# EAGLE design r0ket_v2 (EAGLE 6.2)
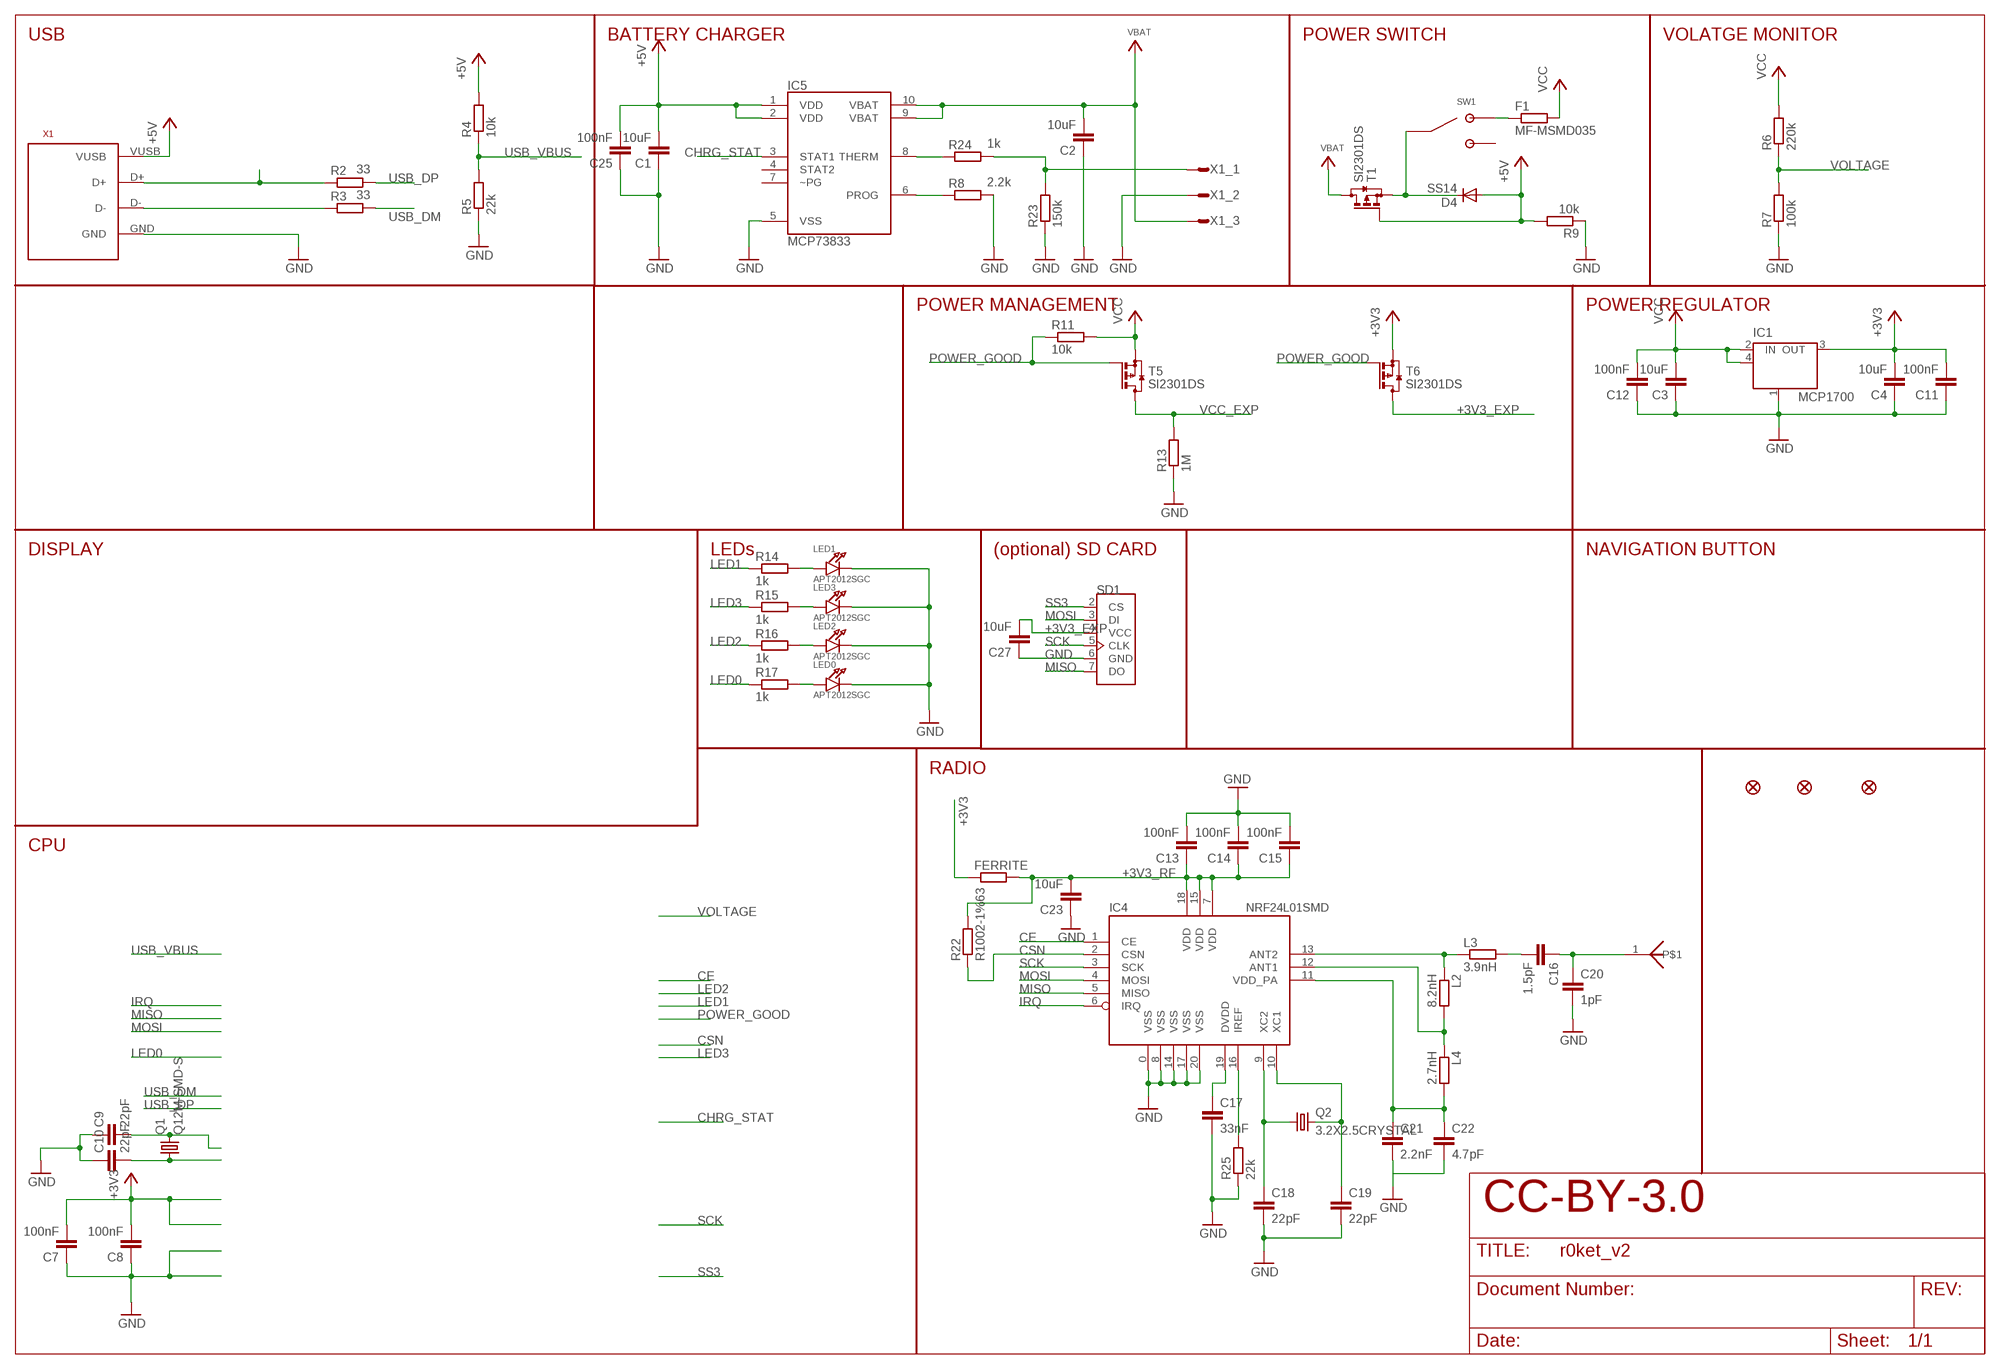
[diagram p0: schematic, sheet 1]

## Parts
ANT  CHIPANTENNA  [CHIPANTENNA]
C1  10uF  C-EUC0805K  [C0805K]
C2  10uF  C-EUC0805K  [C0805K]
C3  10uF  C-EUC0805K  [C0805K]
C4  10uF  C-EUC0805K  [C0805K]
C7  100nF  C-EUC0402K  [C0402K]
C8  100nF  C-EUC0402K  [C0402K]
C9  22pF  C-EUC0402K  [C0402K]
C10  22pF  C-EUC0402K  [C0402K]
C11  100nF  C-EUC0402K  [C0402K]
C12  100nF  C-EUC0402K  [C0402K]
C13  100nF  C-EUC0402K  [C0402K]
C14  100nF  C-EUC0402K  [C0402K]
C15  100nF  C-EUC0402K  [C0402K]
C16  1.5pF  C-EUC0402K  [C0402K]
C17  33nF  C-EUC0402K  [C0402K]
C18  22pF  C-EUC0402K  [C0402K]
C19  22pF  C-EUC0402K  [C0402K]
C20  1pF  C-EUC0402K  [C0402K]
C21  2.2nF  C-EUC0402K  [C0402K]
C22  4.7pF  C-EUC0402K  [C0402K]
C23  10uF  C-EUC0805K  [C0805K]
C25  100nF  C-EUC0402K  [C0402K]
C27  10uF  C-EUC0805K  [C0805K]
D4  SS14  DIODE-SMB  [SMB]
F1  MF-MSMD035  R-EU_R1210  [R1210]
FERRITE  R-EU_R0805  [R0805]
FID1  FIDUCIAL1.5X3  [FIDUCIAL-1.5X3]
FID2  FIDUCIAL1.5X3  [FIDUCIAL-1.5X3]
FID3  FIDUCIAL1.5X3  [FIDUCIAL-1.5X3]
IC1  MCP1700  [SOT89]
IC4  NRF24L01SMD  [QFN20]
IC5  MCP73833  [MSOP-10]
L2  8.2nH  R-EU_R0402  [R0402]
L3  3.9nH  R-EU_R0402  [R0402]
L4  2.7nH  R-EU_R0402  [R0402]
LED0  APT2012SGC  LED0805  [CHIPLED_0805]
LED1  APT2012SGC  LED0805  [CHIPLED_0805]
LED2  APT2012SGC  LED0805  [CHIPLED_0805]
LED3  APT2012SGC  LED0805  [CHIPLED_0805]
Q1  Q12M-SMD-S  CRYSTALCTS406  [CTS406]
Q2  3.2X2.5CRYSTAL  [CRYSTAL3.2X2.5]
R2  33  R-EU_R0603  [R0603]
R3  33  R-EU_R0603  [R0603]
R4  10k  R-EU_R0603  [R0603]
R5  22k  R-EU_R0603  [R0603]
R6  220k  R-EU_R0603  [R0603]
R7  100k  R-EU_R0603  [R0603]
R8  2.2k  R-EU_R0603  [R0603]
R9  10k  R-EU_R0603  [R0603]
R11  10k  R-EU_R0603  [R0603]
R13  1M  R-EU_R0603  [R0603]
R14  1k  R-EU_R0603  [R0603]
R15  1k  R-EU_R0603  [R0603]
R16  1k  R-EU_R0603  [R0603]
R17  1k  R-EU_R0603  [R0603]
R22  R1002-1%63  R-EU_R0603  [R0603]
R23  150k  R-EU_R0603  [R0603]
R24  1k  R-EU_R0603  [R0603]
R25  22k  R-EU_R0603  [R0603]
SD1  MICROSD_SF-MICROSD  [MICROSD_MICROSD]
SW1  JS102011SAQN  [JS102011SAQN]
T1  SI2301DS  BSS84  [SOT23]
T5  SI2301DS  BSS84  [SOT23]
T6  SI2301DS  BSS84  [SOT23]
X1  MICROUSB  [MICROAB]
X1_  JST-PH3  [JST-PH3]

## Nets
+3V3 [GND/3V3]: C4.2 C7.2 C8.2 C11.2 FERRITE.1 IC1.3(OUT) T6.2(S)
+3V3_EXP [FAT]: C27.2 SD1.4(VCC) T6.3(D)
+3V3_RF: C13.1 C14.1 C15.1 C23.2 FERRITE.2 IC4.7(VDD) IC4.15(VDD) IC4.18(VDD) R22.2
+5V [FAT]: C1.2 C25.2 D4.A IC5.1(VDD) IC5.2(VDD) R4.2 R9.2 T1.1(G) X1.VUSB
CE: IC4.1(CE)
CHRG_STAT: IC5.3(STAT1)
CSN: IC4.2(CSN) R22.1
D+: R2.2 X1.D+
D-: R3.2 X1.D-
GND [GND/3V3]: C1.1 C2.1 C3.1 C4.1 C7.1 C8.1 C9.1 C10.1 C11.1 C12.1 C13.2 C14.2 C15.2 C17.2 C18.2 C19.2 C20.2 C21.2 C22.2 C23.1 C25.1 C27.1 IC1.1(GND/ADJ) IC4.0(VSS) IC4.8(VSS) IC4.14(VSS) IC4.17(VSS) IC4.20(VSS) IC5.5(VSS) LED0.C LED1.C LED2.C LED3.C R5.1 R7.1 R8.1 R9.1 R13.1 R23.1 R25.1 SD1.6(GND) X1.GND X1_.2
IRQ: IC4.6(IRQ)
LED0: R17.1
LED1: R14.1
LED2: R16.1
LED3: R15.1
MISO: IC4.5(MISO) SD1.7(DO)
MOSI: IC4.4(MOSI) SD1.3(DI)
N$1: C9.2 Q1.3
N$2: IC5.8(THERM) R24.2
N$3: C10.2 Q1.1
N$4: LED0.A R17.2
N$5: LED2.A R16.2
N$6: LED3.A R15.2
N$7: R23.2 R24.1 X1_.1
N$8 [FAT]: D4.C SW1.2 T1.2(S)
N$9: LED1.A R14.2
N$10: C18.1 IC4.9(XC2) Q2.1
N$11: C19.1 IC4.10(XC1) Q2.3
N$12 [GND/3V3]: ANT.1 C16.1 C20.1
N$13: IC5.6(PROG) R8.2
N$15 [FAT]: F1.1 SW1.1
N$70: C17.1 IC4.19(DVDD)
N$71: IC4.16(IREF) R25.2
N$73: C21.1 C22.1 IC4.11(VDD_PA) L4.2
N$78: IC4.12(ANT1) L2.2 L4.1
N$79: IC4.13(ANT2) L2.1 L3.1
N$80: C16.2 L3.2
POWER_GOOD: R11.1 T5.1(G) T6.1(G)
SCK: IC4.3(SCK) SD1.5(CLK)
SS3: SD1.2(CS)
USB_DM: R3.1
USB_DP: R2.1
USB_VBUS: R4.1 R5.2
VBAT [FAT]: C2.2 IC5.9(VBAT) IC5.10(VBAT) T1.3(D) X1_.3
VCC: C3.2 C12.2 F1.2 IC1.2(IN) IC1.4(IN) R6.2 R11.2 T5.2(S)
VCC_EXP [FAT]: R13.2 T5.3(D)
VOLTAGE: R6.1 R7.2
Unconnected: IC5.4(STAT2) IC5.7(~PG) SW1.3

## Notes on the sheet
- USB | BATTERY CHARGER | POWER SWITCH | VOLATGE MONITOR
- POWER MANAGEMENT | POWER REGULATOR
- DISPLAY | LEDs | (optional) SD CARD | NAVIGATION BUTTON
- RADIO
- CPU
- CC-BY-3.0

## Library data of the parts
ANT = badge:CHIPANTENNA
C1-C4 C7-C23 C25 C27 = rcl:C-EU: CAPACITOR, European symbol
D4 = diode:DIODE-: DIODE
F1 FERRITE L2-L4 R2-R9 R11 R13-R17 R22-R25 = rcl:R-EU_: RESISTOR, European symbol
FID1-FID3 = SparkFun:FIDUCIAL: Fiducial Alignment Points Various fiducial points for machine vision alignment.
IC1 = badge:MCP1700
IC4 = SparkFun:NRF24L01: 2.4GHz Low Power Transceiver This is the very popular, low cost, very low power RF transceiver from Nordic Semiconductor. Simple SPI interface. SKU: COM-00690
IC5 = SparkFun:MCP73833: Microchip MCP73833 Stand-alone Linear Li-ion/Li-polymer Charge Management Controller Packages: DFN-10, MSOP-10 Last modified: 8/17/10 Unproven!
LED0 LED1-LED3 = microbuilder:LED: LED 0603 - 0603 Surface Mount Package Green LED - Low Power (3.9mcd, 2ma, 1.7Vf) Orange LED - Low Power (9.8mcd, 2ma, 1.8Vf) Red LED - Low Power (5mcd, 2ma, 1.8Vf) Yellow LED - Low Power (7mcd, 2ma, 1.8Vf) 0805 - 0805 Surface Mount Package 20mA: Red LED (104mcd, 20mA, Diffused) - LS R976 [Digikey: 475-1278-6-ND] Red LED (12mcd, 20mA, 2.0Vf, Clear) - APT2012EC [Digikey: 754-1128-1-ND] Green LED (15mcd, 20mA, 2.2Vf, Clear) - APT2012GC [Digikey: 754-1131-1-ND] Orange LED (160mcd, 20mA, 2.1Vf, Clear) - APT2012SECK [Digikey: 754-1130-1-ND] 2mA: Red LED (8.8mcd, 2mA, 1.8Vf, Clear) - Low Power [Digikey: 475-2510-1-ND] Green LED (5mcd, 2mA, 1.8Vf, Clear) - Low Power [Digikey: 475-2730-1-ND] Yellow LED (11.3mcd, 2mA, 1.8Vf, Clear) - Low Power [Digikey: 475-2555-1-ND] 1206 - 1206 Surface Mount Package Green LED (26mcd, 20mA, Diffused) - LG N971 [Digikey: 475-1407-6-ND] Red LED (15mcd, 20mA, Diffused) - LH N974 [Digikey: 475-1416-6-ND]
Q1 = crystal:CRYSTAL: CRYSTAL; OC_FARNELL: unknown; OC_NEWARK: unknown
Q2 = badge:3.2X2.5CRYSTAL
SD1 = sd:MICROSD_SF-MICROSD
SW1 = badge:JS102011SAQN
T1 T5 T6 = transistor-small-signal:BSS84: P-CHANNEL MOS FET
X1 = badge:MICROUSB
X1_ = badge:JST-PH3

## Net classes
1 FAT: width 0.2 mm, drill 0.4 mm
2 GND/3V3: width 0.2 mm, drill 0.4 mm

## Board
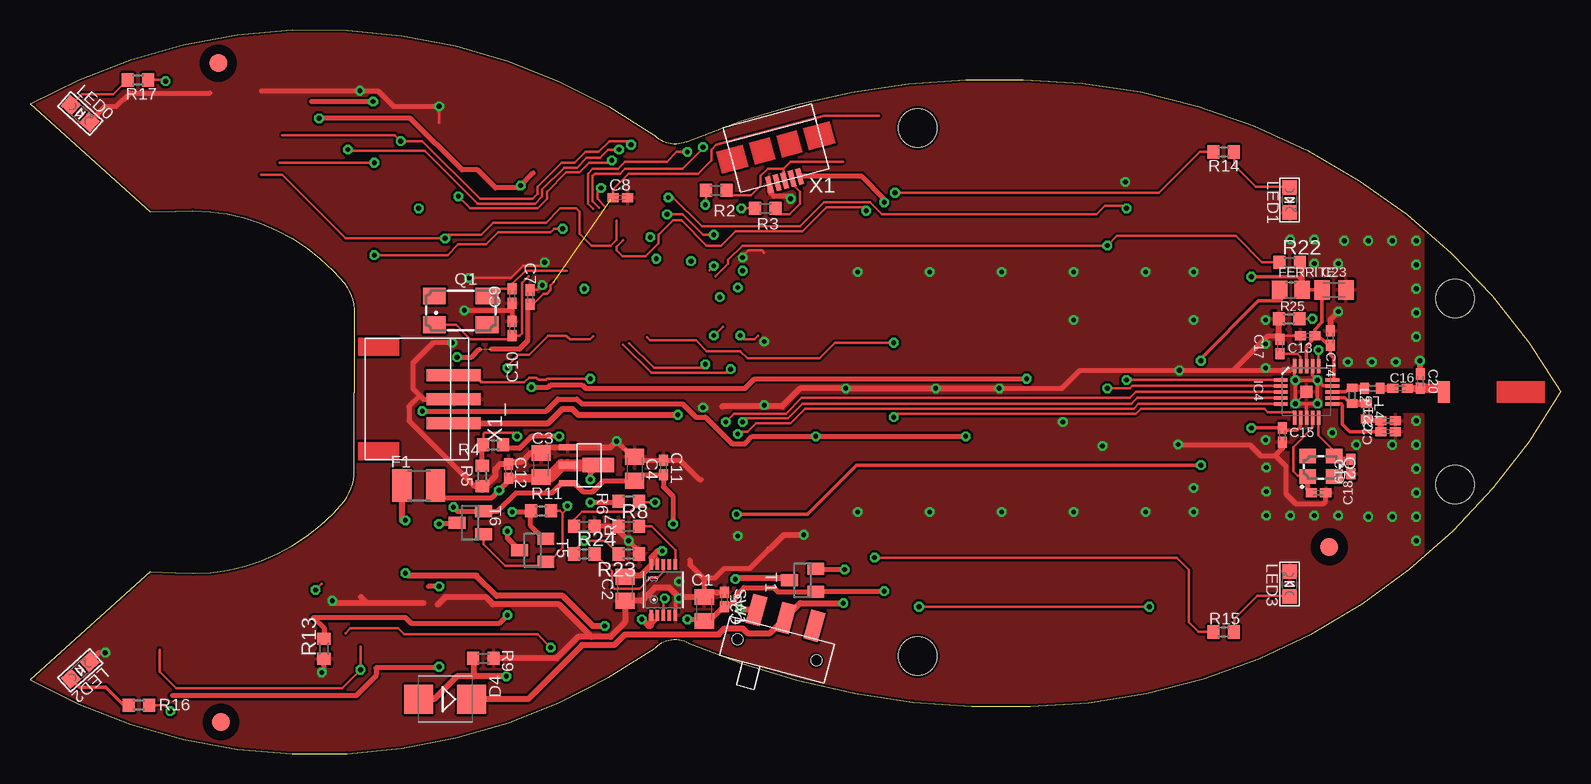
[diagram p1: board, top side]
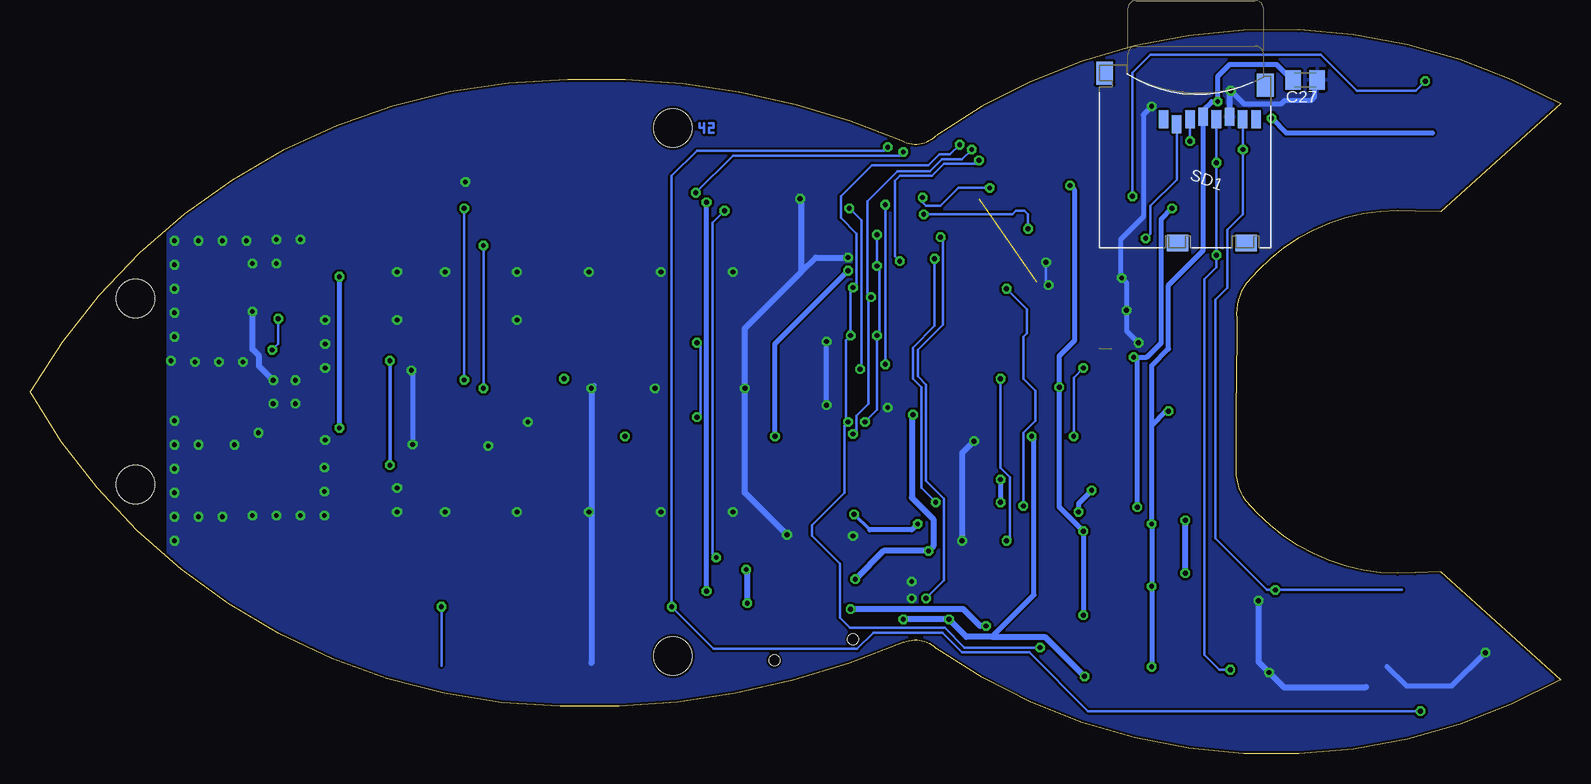
[diagram p2: board, bottom side, seen from below]

Size 127.6 x 60.33 mm. Coordinates in mm from the lower left corner, seen from the top.
Outline: 0,54.16 arc-64 52.1,51.51 arc62 54.52,50.93 54.73,51.02 arc-25 82.8,56.16 arc-59 127.6,30.16 arc-59 83.4,3.96 arc-25 54.73,9.3 54.52,9.39 arc62 52.1,8.81 arc-64 0,6.16 10,15.16 12.14,15.09 arc55 26.23,21.11 arc41 27.02,24 27.02,30.11 27.01,36.31 arc41 26.22,39.2 arc55 12.13,45.22 10,45.16 0,54.16
Copper layers (1*16): Top 0.035mm / dielectric 1.5mm / Bottom 0.035mm
Design rules "default *": minimum track width 0.2mm, minimum drill 0.4mm, track to track 0.2mm, track to pad 6mil, pad to pad 6mil, via to via 0.2mm, smd to smd 6mil, copper to edge 0.2mm, drill to drill 8mil, minimum pad ring 8mil, minimum via ring 0.2mm, stop-mask expansion 4mil, vias tented up to drill 0.4mm, thermal gap 10mil
Holes 3.2 mm at 118.8,37.96 74,8.16 74,52.16 118.8,22.46
tRestrict: area 14.5,1.2 to 17.3,4.1; area 14.3,56.1 to 17.1,59; area 106.9,15.8 to 109.7,18.7

### Footprints (pad centres in the part's own frame; a part is rotated, then mirrored left to right if it is on the bottom)
CHIPANTENNA = smd 1 x 1.8: 1 -2.45,0
C0805K = smd 1.3 x 1.6: 1 -1,0; 2 1,0
C0402K = smd 0.925 x 0.74: 1 -0.6,0; 2 0.6,0
SMB = smd 2.4 x 2.4: A 2.2,0; C -2.2,0
R1210 = smd 1.6 x 2.7: 1 -1.4,0; 2 1.4,0
R0805 = smd 1.3 x 1.5: 1 -0.95,0; 2 0.95,0
FIDUCIAL-1.5X3 = smd 1.5 x 1.5: 1 0,0
SOT89 = smd 0.48 x 1.4: 1 -1.5,-1.6; 3 1.5,-1.6 | smd 0.56 x 1.4: 2 0,-1.6 | smd 1.2 x 2.6: 4 0,0.97
QFN20 = smd 1 x 1: 0 0,0 | smd 1.158 x 0.3: 1 -2.154,1; 2 -2.154,0.5; 3 -2.154,0; 4 -2.154,-0.5; 5 -2.154,-1; 11 2.154,-1; 12 2.154,-0.5; 13 2.154,0; 14 2.154,0.5; 15 2.154,1 | smd 0.3 x 1.158: 6 -1,-2.154; 7 -0.5,-2.154; 8 0,-2.154; 9 0.5,-2.154; 10 1,-2.154; 16 1,2.154; 17 0.5,2.154; 18 0,2.154; 19 -0.5,2.154; 20 -1,2.154
MSOP-10 = smd 0.305 x 0.889: 1 -1,-2.11; 2 -0.5,-2.11; 3 0,-2.11; 4 0.5,-2.11; 5 1,-2.11; 6 1,2.11; 7 0.5,2.11; 8 0,2.11; 9 -0.5,2.11; 10 -1,2.11
R0402 = smd 0.7 x 0.9: 1 -0.65,0; 2 0.65,0
CHIPLED_0805 = smd 1.2 x 1.2: A 0,-1.05; C 0,1.05
CTS406 = smd 1.9 x 1.4: 1 -2.2,-1.2; 2 2.2,-1.2; 3 2.2,1.2; 4 -2.2,1.2
CRYSTAL3.2X2.5 = smd 1.4 x 1.2: 1 -1.1,-0.85; 2 1.1,-0.85; 3 1.1,0.85; 4 -1.1,0.85
R0603 = smd 1 x 1.1: 1 -0.85,0; 2 0.85,0
MICROSD_MICROSD = smd 0.8 x 1.5: 1 -1.94,2.7; 2 -0.84,2.3; 3 0.26,2.7; 4 1.36,2.9; 5 2.46,2.7; 6 3.56,2.9; 7 4.66,2.7; 8 5.76,2.7 | smd 1.4 x 1.9: NC -6.85,6.55; NC3 6.55,5.55 | smd 1.8 x 1.4: NC1 -0.75,-7.6; NC2 4.95,-7.6
JS102011SAQN = smd 1.2 x 2.5: 1 -2.5,2.75; 2 0,2.75; 3 2.5,2.75 | hole 0.9: 3.4,0; -3.4,0
SOT23 = smd 1 x 1.4: 1 -0.95,-1.1; 2 0.95,-1.1; 3 0,1.1
MICROAB = smd 0.4 x 1.4: D+ 0,0; D- -0.65,0; GND 1.3,0; KEY 0.65,0; VUSB -1.3,0
JST-PH3 = smd 1 x 4.5: 1 2,0; 2 0,0; 3 -2,0

### Placement (x,y rotation side)
ANT  120.3,30.16 0 top
C1  56.2,12.06 270 top
C2  49.6,13.76 90 top
C3  42.6,24.06 270 top
C4  50.4,23.76 270 top
C7  41.7,38.06 270 top
C8  49.2,46.36 180 top
C9  40.2,38.16 90 top
C10  40.2,35.46 270 top
C11  52.8,23.86 270 top
C12  39.9,23.56 270 top
C13  106.5,34.86 180 top
C14  108.4,34.66 90 top
C15  104.4,26.56 270 top
C16  114.2,30.46 180 top
C17  104.2,33.96 90 top
C18  107.4,21.76 0 top
C19  110.1,23.96 270 top
C20  115.9,31.06 90 top
C21  113.2,27.76 0 top
C22  113.2,26.86 0 top
C23  108.7,38.66 180 top
C25  57.9,12.86 270 top
C27  21.3,56.16 180 bottom
D4  34.6,4.56 180 top
F1  32.4,22.36 0 top
FERRITE  105.1,38.66 0 top
FID1  15.9,2.66 0 top
FID2  108.3,17.26 0 top
FID3  15.7,57.56 0 top
IC1  46.4,24.06 270 top
IC4  106.4,30.16 0 top
IC5  52.8,13.66 0 top
L2  110.2,29.86 270 top
L3  111.9,30.46 0 top
L4  111.4,28.56 270 top
LED0  4.19,53.36 228 top
LED1  105,46.16 180 top
LED2  4.19,6.96 312 top
LED3  105,14.16 0 top
Q1  35.9,36.96 0 top
Q2  107.6,23.96 0 top
R2  57.2,46.96 0 top
R3  61.3,45.46 0 top
R4  38.6,25.76 0 top
R5  37.7,23.16 90 top
R6  49.9,21.06 180 top
R7  46.2,18.96 180 top
R8  49.9,18.96 0 top
R9  37.8,7.96 180 top
R11  42.6,20.26 180 top
R13  24.5,8.76 90 top
R14  99.5,50.16 0 top
R15  99.5,10.16 0 top
R16  9.07,4.06 180 top
R17  9,56.16 180 top
R22  105,40.96 0 top
R23  49.9,16.66 180 top
R24  46.2,16.66 0 top
R25  104.95,36.26 0 top
SD1  31.17,50.19 0 bottom
SW1  62.27,8.68 345 top
T1  64.4,14.46 90 top
T5  41.9,16.96 90 top
T6  36.7,19.26 90 top
X1  62.91,47.78 195 top
X1_  35.3,29.56 90 top

### Tracks (layer width: path | path; a pad name or v marks a point on that pad's centre or on a via)
+3V3  (via drill 0.4)  (2 unrouted)
  Top 0.2: C7.2 41.8,37.56 42,37.56 42.8,38.36 43.1,38.36 43.4,38.66 43.4,39.06 43.65,39.31 | 70.75,53.16 66.2,53.16 57.2,50.76 56.8,50.36 56.8,49.46 55.7,48.36 49.9,48.36 48.6,47.06 C8.2 48.45,46.21
  Top 0.3: FERRITE.1 104.3,38.66 104.3,37.86 104.2,37.76 102.4,37.76 97.5,32.86 v97.6,32.76 | v97.6,24.06 68.9,24.06 64.8,19.96 v58.9,19.96
  Top 0.4: v35.3,20.56 35.65,20.21 T6.2 38.95,20.21 40.5,21.76 43.5,21.76 44.3,22.56 IC1.3 45.4,22.56 46.1,21.86 46.9,21.86 47.8,22.76 C4.2 51,22.76 51,23.26 C11.2 52.8,22.26 53.6,21.46 v53.6,19.16 | C7.2 41.5,37.26 41.5,34.46 40.8,33.76 38.45,33.76 | 37.45,33.71 36.8,33.06 v35.6,33.06
  Bottom 0.3: v97.6,24.06 v97.6,32.76 | 57.6,18.66 v58.9,19.96
  Bottom 0.4: v32.4,45.46 33.3,44.56 33.3,34.26 34.5,33.06 v35.6,33.06 35.3,32.76 v35.3,20.56 | 57.6,18.66 54.1,18.66 v53.6,19.16
+3V3_EXP  (via drill 0.4)
  Top 0.2: v59.4,40.26 59.4,40.31
  Top 0.4: v34.1,19.16 35.5,19.16 T6.3 | v78,26.46 v65.5,26.46 60.2,26.46 59.6,25.86 58.5,25.86 56.3,28.06 55.5,28.06 54.4,29.16 46,29.16 45.6,29.56 44,29.56 43,28.56 v32.7,28.56 32.8,28.46 | v34.1,7.26 34,7.16 28.84,7.16 28.84,6.5 27.2,4.86 11.86,4.86 | v28.6,54.36 23.46,54.36 | v34.1,13.96 33.2,13.96
  Bottom 0.4: SD1.4 29.8,53.66 29.1,54.36 v28.6,54.36 28.6,56.46 27.6,57.46 23.7,57.46 22.4,56.16 C27.2 | SD1.4 | v34.1,7.26 v34.1,13.96 v34.1,19.16 34.1,27.36 | SD1.4 29.8,41.96 32.7,39.06 32.7,33.76 34.1,32.36 34.1,27.36 | v32.7,28.56 32.9,28.56 34.1,27.36 | v65.5,26.46 65.5,34.16 v59.4,40.26
+3V3_RF  (via drill 0.4)
  Top 0.2: 107.1,34.66 C13.1 107.4,34.86 | 108.7,31.31 IC4.15 | 108,34.26 108.1,34.26 108.3,34.06 C14.1 | C15.1 104.6,26.96
  Top 0.3: 107.1,34.66 106.4,33.96 IC4.18 | C14.1 108.4,33.26 108.7,32.96 108.7,31.31 | 107.4,34.86 108,34.26 | 104.6,26.96 105.6,26.96 105.9,27.26 IC4.7 | C13.1 107.1,35.36 107.7,35.96 C23.2 FERRITE.2 106.1,38.71 106.1,39.36 105.7,39.76 v101.8,39.76 | v101.8,27.16 C15.1
  Top 0.4: R22.2 106.05,40.76 FERRITE.2
  Bottom 0.4: v101.8,27.16 v101.8,39.76
+5V  (via drill 0.4)
  Top 0.3: IC5.2 52.3,11.26 51.8,10.76
  Top 0.4: X1.VUSB 69.34,48.12 71.2,46.26 v71.2,45.96 | v71.2,13.56 65.55,13.56 T1.1 62.35,13.51 62,13.86 59.5,13.86 58.8,13.16 58.8,12.86 58.2,12.26 C25.2 57.8,12.26 56.6,11.06 C1.2 56.25,11.21 v54.8,11.21 | v44.1,26.46 41.8,26.46 40.8,25.46 39.75,25.46 R4.2 | v39.7,6.46 39.75,6.41
  Top 0.5: 37,6.46 37,7.96 R9.2 | 37,6.46 35.6,6.46 33.7,4.56 D4.A | v39.7,6.46 37,6.46 | IC5.1 51.8,10.76 51.7,10.66 51.55,10.66 v51,11.21
  Bottom 0.4: v71.2,13.56 v71.2,45.96 | 47.4,9.76 43.9,13.26 43.9,26.26 v44.1,26.46
  Bottom 0.5: v54.8,11.21 v51,11.21 49.55,9.76 47.4,9.76 43,9.76 v39.7,6.46
CE  (via drill 0.4)
  Top 0.2: v47.6,47.16 47.3,46.86 47.3,46.26 47.95,45.61 | v53.2,46.36 53.6,46.36 56,43.96 64.2,43.96 66.2,45.96 70,45.96 71,44.96 88.9,44.96 89.6,45.66 91.2,45.66 v91.4,45.46 | v91.4,31.16 IC4.1
  Bottom 0.2: v47.6,47.16 50.2,47.16 51.7,45.66 52.9,45.66 53.2,45.96 v53.2,46.36 | v91.4,45.46 v91.4,31.16
CHRG_STAT  (via drill 0.4)
  Top 0.2: v51.7,43.06 51.45,43.31 | v52.9,12.96 52.8,12.86 IC5.3
  Bottom 0.2: v51.7,43.06 51.5,42.86 51.5,35.76 53.6,33.66 53.6,31.46 52.9,30.76 52.9,22.76 51.4,21.26 51.4,14.46 v52.9,12.96
CSN  (via drill 0.4)
  Top 0.2: v89.8,30.46 91.7,30.46 91.9,30.66 IC4.2 | 57.15,39.81 58.2,40.86 58.2,41.16 59.4,42.36 v89.8,42.36 90.6,43.16 100.5,43.16 102.7,40.96 R22.1
  Bottom 0.2: v89.8,42.36 v89.8,30.46
D+
  Top 0.2: 62.7,48.26 62.91,48.06 X1.D+ arc-90 62.8,47.89 62.8,48.76 | R2.2 58.45,46.56 60.1,46.56 60.9,47.36 60.9,48.16 61.5,48.76 62.8,48.76 | 62.8,48.76 63.4,49.36 67.75,49.36
D-
  Top 0.2: R3.2 62.2,45.46 62.2,44.96 63.3,44.96 64.2,45.86 64.2,46.86 63.54,47.53 X1.D-
GND  (via drill 0.4)
  Top 0.2: v36.6,39.66 40.1,39.66 41.1,40.66 42.6,40.66 v42.9,40.96 | v42.9,40.96 42.8,40.86 | 49.95,46.21 C8.1 | v42.9,40.96 43.05,40.81 | v34.1,53.96 34.1,52.61 | 105.35,32.32 105.39,32.32 IC4.20 | 105.39,31.23 v105.48,31.14 | v105.48,29.19 105.51,29.19 105.51,29.27 IC4.0 | 105.52,31.14 105.49,31.16 | 106.32,29.19 106.4,29.11 | C7.1 42.3,38.66 v42.7,39.06 | C15.2 104.3,25.86 | C17.2 104.22,34.59 104.22,34.84 105.6,34.84 105.62,34.86 C13.2 | 61.2,41.76 61,41.96 59.9,41.96 59.4,41.46 v59.4,41.36 | R8.1 49.1,18.96
  Top 0.3: 61.6,17.06 61.64,17.06 | 37.4,22.46 37.55,22.31 R5.1 | 105.39,32.32 105.39,31.23 | IC4.17 106.9,31.56 v107.32,31.14 | v105.48,31.14 v105.48,29.19 | 105.51,29.19 106.32,29.19 v107.32,29.19 v107.32,31.14 | v107.32,31.14 105.52,31.14 | IC4.14 107.8,30.66 v107.32,31.14 | 106.4,29.11 IC4.8 | 105.05,31.96 IC4.20 | IC5.5 53.8,12.66 54.2,13.06
  Top 0.4: 39.9,24.36 39.8,24.26 C12.1 | 61.6,17.06 60,15.46 57.9,15.46 57.1,14.66 56.1,14.66 | 56.1,14.66 55,15.76 55,16.15 | 55.96,22.86 55.8,22.86 54.2,24.46 C11.1 50.6,24.46 50.6,24.76 C4.1 49.8,24.76 49.8,25.16 v48.9,26.06 | v34.1,53.96 30.3,53.96 29,55.26 v27.5,55.26 19.28,55.26 | v80.8,30.46 86,30.46 87.5,31.96 v95.8,31.96 100.33,31.96 | 100.33,31.96 105.05,31.96 | 104.22,34.84 103.2,34.84 100.33,31.96 | v63.4,46.26 63.2,46.46 62,46.46 61.65,46.81 X1.GND | 15,55.06 8.3,55.06 7.2,53.96 6.27,53.96 LED0.C | v6.28,8.44 5.75,8.44 LED2.C | R7.1 R8.1 49.05,18.61 v49.9,17.76 50.75,16.91 R23.1 | 56.1,14.66 56.2,14.46 C1.1 | v95.7,25.79 95.73,25.76 101.7,25.76 102.6,24.86 103.8,24.86 | 24.48,7.89 R13.1 24.5,6.96 v24.32,6.79 | 32.5,29.86 31.9,30.46 31.9,32.56 33.6,34.26 v35.2,34.26 | 32.5,29.86 32.8,29.56 X1_.2 | 37,22.36 31.6,27.76 31.6,28.96 32.5,29.86 | 40.2,36.96 C10.1 | 40.2,36.96 C9.1 | v36.2,36.96 40.2,36.96 | 103.8,24.86 104.4,25.46 C15.2 | C18.2 108,21.06 107.8,20.86 105.5,20.86 104.7,21.66 104.7,23.96 103.8,24.86
  Top 0.5: 28.1,12.56 25.4,12.56 v25.2,12.76 | 28.1,12.56 27.57,13.1 | v80.8,30.46 v75.5,30.46 v68,30.46 64.2,30.46 62.7,28.96 61.3,28.96 v61.2,29.06 61.1,28.96 57.7,28.96 | R9.1 43.9,7.96 45.7,9.76 46.8,9.76 | 46.8,9.76 44.1,12.46 38.6,12.46 38,13.06 34.6,13.06 34,12.46 | 46.8,9.76 48.4,9.76 49.6,10.96 C2.1 51,12.76 52.1,13.86 53.3,13.86 54.1,13.06 54.2,13.06 C1.1 56.8,13.46 C25.1 | 61.64,17.06 62.84,18.26 v64.5,18.26 | C14.2 108.4,36.21 v109.05,36.86 | C17.2 104.1,34.66 R25.1 | v48.9,26.06 48.4,25.56 IC1.1 43.1,25.56 C3.1 41.7,25.06 41,24.36 39.9,24.36 | 37,22.36 37.65,22.36 R5.1 37.95,22.31 38.8,23.16 38.8,23.76 39.2,24.16 C12.1 | 32.8,12.56 28.1,12.56 | C20.2 115.9,32.61 v115.85,32.76
  Bottom 0.2: v42.9,40.96 42.9,39.16 42.8,39.16 v42.7,39.06 | 63.3,46.16 v63.4,46.26 | 108.4,32.16 108.4,32.22
  Bottom 0.4: v61.2,29.06 v61.2,34.36 | v80.8,30.46 80.54,30.72 | v95.7,25.79 95.7,31.87 v95.8,31.96 | v6.28,8.44 9.06,5.66 12.85,5.66 14.49,7.3 | v35.2,34.26 36.2,35.26 v36.2,36.96 36.2,39.26 v36.6,39.66 36.7,39.76 36.7,42.86 34.8,44.76 34.8,53.26 v34.1,53.96 | C27.1 20.5,55.96 20.5,54.76 20.8,54.46 23,54.46 23.3,54.16 26.4,54.16 v27.5,55.26
  Bottom 0.5: 63.3,40.16 68,35.46 v68,30.46 68,21.76 v64.5,18.26 | 63.3,40.16 63.3,46.16 | SD1.6 27.61,55.16 v27.5,55.26 | 16.24,5.56 23.1,5.56 v24.32,6.79 25.2,7.66 v25.2,12.76 | v59.4,41.36 62.1,41.36 63.3,40.16 | v80.8,30.46 80.8,7.56 | v48.9,26.06 49.9,25.06 v49.9,17.76 | v109.05,36.86 109.05,33.71 108.5,33.16 108.5,32.32 v107.32,31.14
  other vias: 115.55,25.76 89.4,25.66 91.3,47.66 86.1,27.66 56.1,28.86 103,26.16 115.55,27.76 109.05,19.86 107.05,19.86 105.05,19.86 103.05,19.86 103.05,21.86 103.05,23.86 109.05,40.86 107.05,40.86 107.05,42.86 105.05,42.86 103,32.16 103,34.16 103,36.16 54.1,12.96 54.1,14.36 97,40.16 97,36.16 97,22.16 97,20.16 81,20.16 81,40.16 69,20.16 69,40.16 75,40.16 75,20.16 87,20.16 87,36.16 93,40.16 93,20.16 59,18.16 87,40.16 115.55,23.76 115.55,21.76 115.55,19.76 115.55,17.76 115.55,34.76 115.55,36.76 115.55,38.76 115.55,40.76 115.55,42.76 113.55,19.76 111.55,19.76 113.55,42.76 113.85,32.66 111.85,32.66 113.55,25.76 110.55,25.76 108.55,26.76 109.85,32.66 111.55,42.76 109.55,42.76
  pour Bottom: 116.1,66.86 116.1,-2.14 -16,-1.84 -4.7,62.36
  pour Top: 116.1,66.86 116.1,32.26 107.8,32.26 107.8,29.36 109.7,29.36 109.7,27.66 113.6,27.66 113.6,28.26 116.1,28.26 116.1,-2.14 -16,-1.84 -5.6,62.66
IRQ  (via drill 0.4)
  Top 0.2: v72,28.06 72.3,28.36 92.2,28.36 92.6,28.76 102.9,28.76 103.2,28.46 105.3,28.46 105.4,28.36 IC4.6 | 51.45,34.71 51.7,34.46 55.5,34.46 56.4,33.56 59.2,33.56 59.8,32.96 65.8,32.96 67.1,34.26 v72,34.26
  Bottom 0.2: v72,34.26 71.7,33.96 71.7,28.36 v72,28.06
LED0  (via drill 0.4)
  Top 0.2: v48.5,49.46 48.3,49.26 46.6,49.26 45.8,48.46 44.7,48.46 43.1,46.86 43.1,46.26 42.3,45.46 36.7,45.46 v35.7,46.46 | v55.1,41.06 54.85,40.81 | R17.1 11.2,56.16 v11.3,56.06
  Bottom 0.2: v48.5,49.46 48.8,49.16 51.4,49.16 52.4,48.16 55.1,48.16 55.5,47.76 55.5,41.46 v55.1,41.06 | v35.7,46.46 35.7,56.76 34.2,58.26 20,58.26 17,55.26 12.1,55.26 v11.3,56.06
LED1  (via drill 0.4)
  Top 0.2: v54.8,50.16 53.9,50.16 53.1,49.36 49.6,49.36 49,48.76 46.9,48.76 46.5,48.36 46.5,45.86 46.95,45.41 | 98.7,50.16 R14.1 97.5,50.16 94.1,46.76 93.24,46.76 92.8,46.76 v72.1,46.76
  Bottom 0.2: v54.8,50.16 55.1,49.86 69,49.86 v72.1,46.76
LED2  (via drill 0.4)
  Top 0.2: v56.1,50.56 56.1,50.46 54.4,48.76 49.6,48.76 49.2,48.36 47.1,48.36 46.9,48.16 46.9,46.06 47.45,45.51 | R16.1 11.2,4.06 v11.7,3.56 | v74.1,12.26 v93.3,12.26
  Bottom 0.2: v56.1,50.56 56.4,50.26 72,50.26 74.1,48.16 v74.1,12.26 70.6,8.76 58.65,8.76 57.3,10.11 51.55,10.11 49.9,8.46 44.3,8.46 39.4,3.56 v11.7,3.56 | v93.3,12.26 93.3,7.36
LED3  (via drill 0.4)
  Top 0.2: 49.45,42.81 48.9,42.26 48.9,41.96 49.4,41.46 51.3,41.46 52.4,42.56 52.4,43.26 53.6,44.46 54.3,44.46 56.4,42.36 57.6,42.36 58.8,43.56 64.4,43.56 66.4,45.56 69.4,45.56 v69.7,45.26 | v70.4,16.36 95.6,16.36 96.6,15.36 96.6,10.96 97.4,10.16 R15.1
  Bottom 0.2: v70.4,16.36 70.7,16.66 70.7,44.26 v69.7,45.26
MISO  (via drill 0.4)
  Top 0.2: v49.1,50.36 48.2,50.36 47.5,49.66 46.4,49.66 45.6,48.86 44.5,48.86 42.7,47.06 42.7,46.46 42.1,45.86 37.3,45.86 32.9,50.26 26.6,50.26 v26.5,50.36 26.38,50.48 | v57.5,38.06 57.25,38.31 | v23.8,13.66 24.32,14.18 | IC4.5 92.4,29.16 92,28.76 64.6,28.76 63.4,27.56 60.5,27.56 59.8,26.86 59.2,26.86 v59,26.66
  Bottom 0.2: v49.1,50.36 49.9,49.56 51.6,49.56 52.6,48.56 55.3,48.56 57.8,46.06 57.8,38.36 v57.5,38.06 57.7,37.86 57.7,29.16 58.7,28.16 58.7,26.96 v59,26.66 | SD1.7 v26.5,50.36 26.5,44.96 27.8,43.66 27.8,38.86 28.8,37.86 28.8,17.96 24.5,13.66 v23.8,13.66 13.24,13.66
MOSI  (via drill 0.4)
  Top 0.2: v50.1,50.76 49.8,51.06 48.3,51.06 47.4,50.16 46.3,50.16 45.4,49.26 44.3,49.26 42.3,47.26 42.3,46.66 41.9,46.26 37.5,46.26 32.7,51.06 v30.9,51.06 30.4,51.56 21.04,51.56 | 26.3,10.06 26.7,10.46 30.7,10.46 31.2,9.96 42.3,9.96 v43.4,8.86 | v59.4,27.66 59.7,27.96 63.2,27.96 64.4,29.16 91.8,29.16 92.3,29.66 IC4.4 | v59,38.86 58.95,38.81 | v59.2,34.86 59.5,34.56 60.4,34.56 60.7,34.86
  Bottom 0.2: v50.1,50.76 50.9,49.96 51.8,49.96 52.7,49.06 57.4,49.06 60,46.46 60,44.66 58.7,43.36 58.7,39.16 v59,38.86 59.2,38.66 v59.2,34.86 59.6,34.46 59.6,27.86 v59.4,27.66 59.7,27.36 59.7,21.76 62.4,19.06 62.4,18.16 60.1,15.86 60.1,11.36 59.25,10.51 51.35,10.51 49.7,8.86 v43.4,8.86 | v30.9,51.06 SD1.3
N$1
  Top 0.2: 44.73,40.26 41.3,40.26 40.2,39.16 C9.2 38.7,38.76 Q1.3
N$2
  Top 0.2: R24.2 48.5,15.21 48.5,13.96 48.7,13.76 50.8,13.76 51.7,14.66 52.3,14.66 52.8,15.16 IC5.8
N$3
  Top 0.2: 41.55,39.81 41,39.26 41,35.06 40.8,34.86 C10.2 39.9,34.56 36.7,34.56 35.5,35.76 Q1.1
N$4
  Top 0.2: R17.2 6.95,54.96 4.31,54.96 LED0.A
N$5
  Top 0.2: R16.2 8.2,4.06
  Top 0.3: 8.2,4.06 7.8,4.06 6.3,5.56 4.11,5.56 LED2.A
N$6
  Top 0.2: LED3.A 105,13.16 102.3,13.16 100.4,11.26 100.4,10.16 R15.2
N$7  (via drill 0.4)
  Top 0.2: R24.1 45.4,16.66 45.4,16.96 v46.2,17.76 47.95,17.76 R23.2 | 37.65,31.01 37.1,31.56 X1_.1 | 37.65,31.01 37.7,30.96 | 37.65,31.01 37.6,30.96 41.2,30.96 41.6,31.36 42.2,31.36 42.4,31.16 43,31.16 43.1,31.26 v46.7,31.26
  Bottom 0.2: v46.2,17.76 45.9,18.06 45.9,23.06 46.7,23.86 v46.7,31.26
N$8  (via drill 0.4)
  Top 0.4: 65.5,15.46 T1.2 65.55,15.36 v67.9,15.36
  Top 0.5: D4.C 41.5,4.56 46,9.06 48.7,9.06 49.6,9.96 57.4,9.96 57.9,10.46 59.4,10.46 59.8,10.06 61.7,10.06 SW1.2 64.21,12.56 v67.8,12.56
  Bottom 0.5: v67.8,12.56 67.8,15.26 v67.9,15.36
N$9
  Top 0.2: LED1.A 105,47.26 102.2,47.26 100.4,49.06 100.4,50.16 R14.2
N$10
  Top 0.2: 106.45,23.06 Q2.1 106.45,23.16 105.7,23.16 105.3,23.56 105.3,25.56 106.9,27.16 IC4.9
  Top 0.4: C18.1 106.5,22.06 Q2.1
N$11
  Top 0.2: Q2.3 108.6,24.91 108.6,25.36 107.4,26.56 IC4.10
  Top 0.4: C19.1 108.95,24.56 Q2.3
N$12
  Top 0.6: C16.1 C20.1
  Top 0.8: C20.1 117.75,30.46 ANT.1
N$13
  Top 0.2: R8.2 51.8,18.96 53.8,16.96 IC5.6
N$15  (via drill 0.4)
  Top 0.5: v31.3,15.06 31.5,14.86 37.2,14.86 38.9,13.16 44.4,13.16 46.9,10.66 v47.9,10.66 | F1.1 31,19.46 v31.3,19.46 | v59.2,12.06 60.49,12.06 SW1.1
  Bottom 0.5: v31.3,15.06 v31.3,19.46 | v47.9,10.66 48.4,10.66 49.8,12.06 v59.2,12.06
N$16
  Bottom 0.2: 71.8,52.56 71.8,52.16 71.4,52.16 | 71.4,52.16 71.4,52.56 | 71.4,51.76 71.4,52.16
N$17
  Bottom 0.2: 71,52.56 70.6,52.56 70.6,52.16 71,52.16 71,51.76 70.6,51.76
N$70
  Top 0.2: IC4.19 105.9,33.11 105.65,33.36 104.45,33.36 104.2,33.11 C17.1
N$71  (via drill 0.4)
  Top 0.2: v106.9,36.26 R25.2 | IC4.16 v107.4,33.66
  Bottom 0.2: v106.9,36.26 106.9,34.16 v107.4,33.66
N$73
  Top 0.3: 111.45,27.76 L4.2 | IC4.11 109.3,29.16 109.4,29.06 109.4,27.46 110,26.86 C22.1
  Top 0.4: C21.1 111.45,27.76
  Top 0.5: C22.1 C21.1
N$78
  Top 0.3: IC4.12 109.6,29.66 110.05,29.21 L2.2
  Top 0.6: L2.2 L4.1
N$79
  Top 0.3: 110.15,30.36 L2.1 110.05,30.51 109.7,30.16 IC4.13
  Top 0.6: L2.1 111,30.51 L3.1
N$80
  Top 0.6: L3.2 C16.2
POWER_GOOD  (via drill 0.4)
  Top 0.2: T5.1 42.65,15.66 39.6,15.66 37.8,17.46 T6.1 | v46.2,38.76 46.15,38.81 | 43.6,20.26 R11.1 44.2,20.26 44.4,20.06 | T5.1 43,16.06 | T5.1 43.25,16.01 44.4,17.16 44.4,20.06 | 44.4,20.06 44.8,20.46 v44.8,20.66
  Bottom 0.2: v46.2,38.76 44.5,37.06 44.5,35.06 44.8,34.76 44.8,31.26 43.8,30.26 43.8,27.76 44.8,26.76 v44.8,20.66
SCK  (via drill 0.4)
  Top 0.2: v57,40.66 56.65,40.31 | v44.4,43.76 43.7,43.76 43.4,43.46 39,43.46 38,42.46 35.7,42.46 34.8,41.56 v28.7,41.56 | v53.1,44.96 54.4,44.96 56.1,43.26 v57,43.26 | v58,27.66 58.7,28.36 63,28.36 64.3,29.66 91.7,29.66 92.2,30.16 IC4.3 | v28.7,49.26 20.8,49.26 | 10.8,8.68 10.8,6.86 12.2,5.46 26,5.46 v27.55,7.01 27.55,8.93 | v57,34.86 57.75,35.61
  Bottom 0.2: v44.4,43.76 44.4,44.96 44.7,45.26 45.4,45.26 45.7,44.96 v53.1,44.96 | v57,43.26 v57,40.66 56.8,40.46 56.8,35.06 v57,34.86 57,28.66 v58,27.66 | v28.7,49.26 28.6,49.16 | v28.7,49.26 SD1.5 | v28.7,49.26 v28.7,41.56 28.7,40.56 29.7,39.56 29.7,8.26 28.45,7.01 v27.55,7.01
SS3  (via drill 0.4)
  Top 0.2: 48.9,44.44 48.9,42.86 48.4,42.36 46.8,42.36 45.8,43.36 45.8,45.16 45.5,45.46 44.2,45.46 43,44.26 38.6,44.26 37.6,43.26 34.9,43.26 v34.6,42.96 26.3,42.96 21,48.26 19.26,48.26
  Bottom 0.2: 32.01,51.47 32,51.46 | 32.01,51.47 SD1.2 | v34.6,42.96 34.2,43.36 34.2,45.66 32.01,47.86 32.01,51.47
USB_DM  (via drill 0.4)
  Top 0.2: v59.3,45.46 R3.1 | v58.4,32.06 58.1,31.76 51.8,31.76 49.45,34.11
  Bottom 0.2: v58.4,32.06 58.3,32.16 58.3,44.46 v59.3,45.46
USB_DP  (via drill 0.4)
  Top 0.2: R2.1 56.35,45.96 56.4,45.96 56.4,45.86 v56.3,45.76 | v56.3,32.46 56,32.16 52,32.16 49.95,34.21
  Bottom 0.2: v56.3,32.46 v56.3,45.76
USB_VBUS  (via drill 0.4)
  Top 0.2: v40.6,26.46 40.3,26.76 37.9,26.76 37.8,26.66 37.8,26.01 37.7,25.91 37.75,25.91 R4.1 | v39.8,32.16 39.8,32.36 40.7,33.26 41.6,33.26 43.2,34.86 44.7,34.86 45,34.56 46.7,34.56 46.95,34.81
  Top 0.4: R5.2 37.7,25.91
  Bottom 0.2: v40.6,26.46 40.6,31.36 v39.8,32.16
VBAT  (via drill 0.4)
  Top 0.3: IC5.10 51.8,16.01 | IC5.9 52.3,16.26 52,16.56
  Top 0.5: C2.2 49.7,14.86 50.89,14.86 IC5.10 51.8,16.36 52,16.56 52.35,16.91 v52.7,16.91 | v58.8,14.56 58.9,14.66 63.1,14.66 T1.3 | v54,28.26 45.7,28.26 45.2,28.76 44.4,28.76 43.2,27.56 X1_.3
  Bottom 0.5: v54,28.26 54.1,28.16 54.1,21.36 52.3,19.56 52.3,17.31 v52.7,16.91 56.45,16.91 v58.8,14.56
VCC  (via drill 0.4)
  Top 0.2: R11.2 41.7,20.26 41.7,20.36
  Top 0.4: T5.2 42.85,17.91 41.7,19.06 41.7,20.21 R11.2 41.65,20.16 v40.2,20.16 | F1.2 33.8,21.56 34,21.36 38.5,21.36 v39.1,21.96 39.9,22.76 C12.2 40,23.06 | R6.2 49.15,20.96 v46.7,20.96 | IC1.4 46.7,23.39 v46.7,22.86
  Top 0.7: C3.2 42.5,22.96 C12.2
  Top 1: IC1.4 IC1.2 44.3,24.06 43.3,23.06 C3.2
  Bottom 0.4: v46.7,22.86 v46.7,20.96 | v40.2,20.16 40.2,20.86 v39.1,21.96
VCC_EXP  (via drill 0.4)
  Top 0.4: v39.8,18.56 39.8,17.96 T5.3 | 41.95,48.41 v40.9,47.36 40.7,47.16 38.8,47.16 37.3,48.66 36,48.66 31.7,52.96 v24.1,52.96 | 39.8,11.36 v39.8,11.56 39.1,10.86 31.8,10.86 31.3,11.36 23.64,11.36 24.5,10.5 R13.2 | v83.08,31.26 60.4,31.26 59.6,30.46 46.3,30.46 46,30.76 43.4,30.76 43.2,30.56 v41.8,30.56
  Bottom 0.4: v40.9,47.36 40.5,46.96 40.5,34.46 41.8,33.16 v41.8,30.56 41.8,20.56 v39.8,18.56 v39.8,11.56 | v24.1,52.96 22.9,51.76 10.7,51.76
VOLTAGE  (via drill 0.4)
  Top 0.2: v52.2,41.26 52.25,41.31 | v52.1,20.96 50.85,20.96 R6.1 50.75,20.91 50,20.16 46,20.16 45.35,19.51 R7.2
  Bottom 0.2: v52.2,41.26 52.2,35.66 54,33.86 54,31.26 53.3,30.56 53.3,22.16 v52.1,20.96